# EAGLE schematic JCB_Circuit (EAGLE 9.5.2)
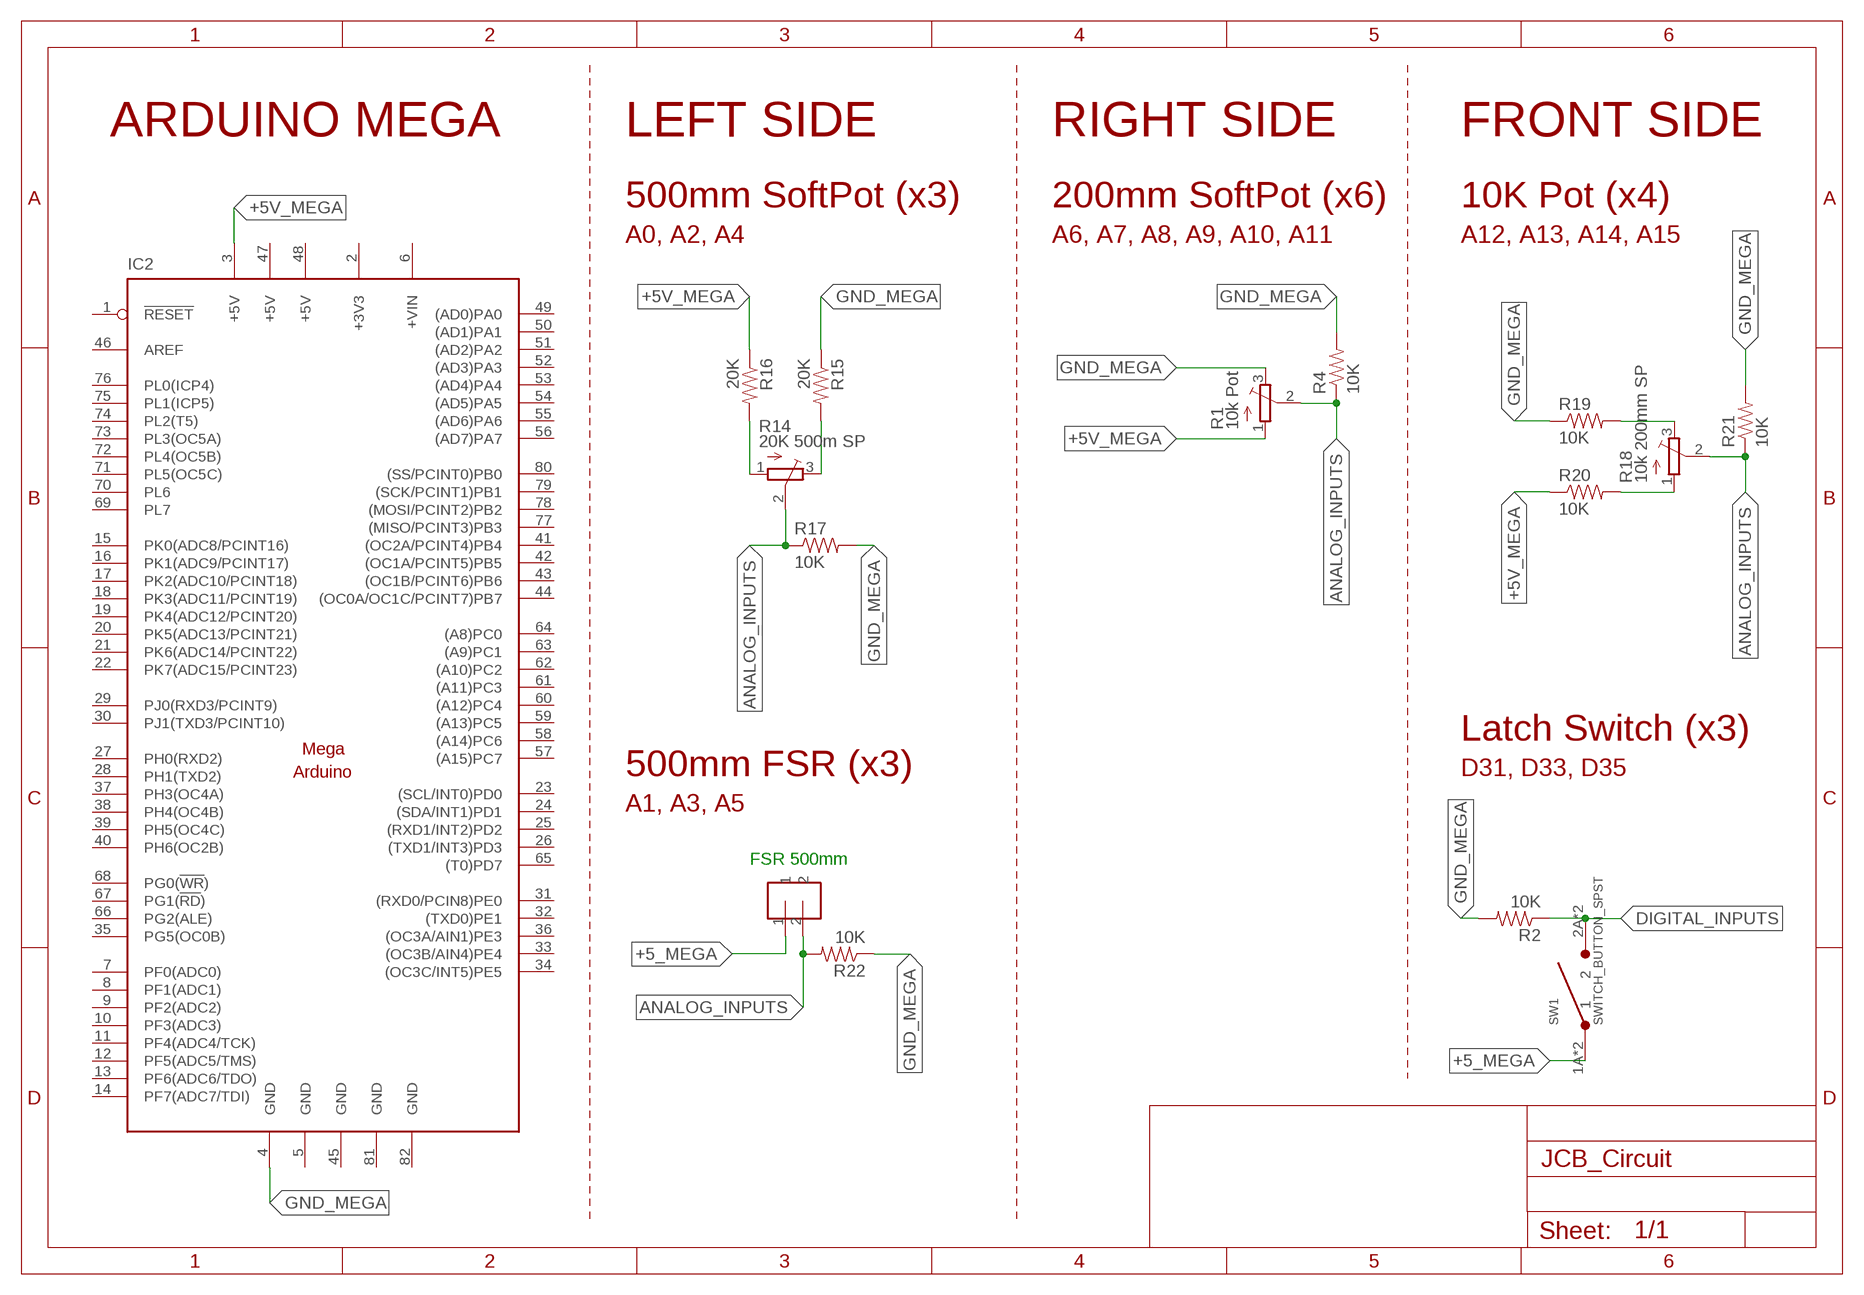
[diagram p0: schematic, sheet 1]

## Parts
IC2  MEGAARDUINO_1  [MEGA_ARDUINO]
R1  10k Pot  TRIM_EU-3223G  [3223G]
R2  10K  COMPONENT_RESISTOR-0805  [0805]
R4  10K  COMPONENT_RESISTOR-0805  [0805]
R14  20K 500m SP  TRIM_EU-3223G  [3223G]
R15  20K  COMPONENT_RESISTOR-0805  [0805]
R16  20K  COMPONENT_RESISTOR-0805  [0805]
R17  10K  COMPONENT_RESISTOR-0805  [0805]
R18  10k 200mm SP  TRIM_EU-3223G  [3223G]
R19  10K  COMPONENT_RESISTOR-0805  [0805]
R20  10K  COMPONENT_RESISTOR-0805  [0805]
R21  10K  COMPONENT_RESISTOR-0805  [0805]
R22  10K  COMPONENT_RESISTOR-0805  [0805]
SW1  SWITCH_BUTTON_SPST  [7914G-1-000E]
U$1  HEADER-2-DIP  [HEADER-2-DIP]

## Nets
+5_MEGA: SW1.1A SW1.1B U$1.1
+5V_MEGA: IC2.3(+5V) R1.1(A) R16.1 R20.1
ANALOG_INPUTS: R1.2(S) R4.1 R14.2(S) R17.1 R18.2(S) R21.1 R22.2 U$1.2
DIGITAL_INPUTS: R2.1 SW1.2A SW1.2B
GND_MEGA: IC2.4(GND) R1.3(E) R2.2 R4.2 R15.1 R17.2 R19.1 R21.2 R22.1
N$4: R14.3(E) R15.2
N$5: R14.1(A) R16.2
N$7: R18.3(E) R19.2
N$8: R18.1(A) R20.2
Unconnected: IC2.1(!RESET) IC2.7(PF0(ADC0)) IC2.8(PF1(ADC1)) IC2.9(PF2(ADC2)) IC2.10(PF3(ADC3)) IC2.11(PF4(ADC4/TCK)) IC2.12(PF5(ADC5/TMS)) IC2.13(PF6(ADC6/TDO)) IC2.14(PF7(ADC7/TDI)) IC2.15(PK0(ADC8/PCINT16)) IC2.16(PK1(ADC9/PCINT17)) IC2.17(PK2(ADC10/PCINT18)) IC2.18(PK3(ADC11/PCINT19)) IC2.19(PK4(ADC12/PCINT20)) IC2.20(PK5(ADC13/PCINT21)) IC2.21(PK6(ADC14/PCINT22)) IC2.22(PK7(ADC15/PCINT23)) IC2.23((SCL/INT0)PD0) IC2.24((SDA/INT1)PD1) IC2.25((RXD1/INT2)PD2) IC2.26((TXD1/INT3)PD3) IC2.27(PH0(RXD2)) IC2.28(PH1(TXD2)) IC2.29(PJ0(RXD3/PCINT9)) IC2.30(PJ1(TXD3/PCINT10)) IC2.31((RXD0/PCIN8)PE0) IC2.32((TXD0)PE1) IC2.33((OC3B/AIN4)PE4) IC2.34((OC3C/INT5)PE5) IC2.35(PG5(OC0B)) IC2.36((OC3A/AIN1)PE3) IC2.37(PH3(OC4A)) IC2.38(PH4(OC4B)) IC2.39(PH5(OC4C)) IC2.40(PH6(OC2B)) IC2.41((OC2A/PCINT4)PB4) IC2.42((OC1A/PCINT5)PB5) IC2.43((OC1B/PCINT6)PB6) IC2.44((OC0A/OC1C/PCINT7)PB7) IC2.46(AREF) IC2.49((AD0)PA0) IC2.50((AD1)PA1) IC2.51((AD2)PA2) IC2.52((AD3)PA3) IC2.53((AD4)PA4) IC2.54((AD5)PA5) IC2.55((AD6)PA6) IC2.56((AD7)PA7) IC2.57((A15)PC7) IC2.58((A14)PC6) IC2.59((A13)PC5) IC2.60((A12)PC4) IC2.61((A11)PC3) IC2.62((A10)PC2) IC2.63((A9)PC1) IC2.64((A8)PC0) IC2.65((T0)PD7) IC2.66(PG2(ALE)) IC2.67(PG1(!RD!)) IC2.68(PG0(!WR!)) IC2.69(PL7) IC2.70(PL6) IC2.71(PL5(OC5C)) IC2.72(PL4(OC5B)) IC2.73(PL3(OC5A)) IC2.74(PL2(T5)) IC2.75(PL1(ICP5)) IC2.76(PL0(ICP4)) IC2.77((MISO/PCINT3)PB3) IC2.78((MOSI/PCINT2)PB2) IC2.79((SCK/PCINT1)PB1) IC2.80((SS/PCINT0)PB0)

## Notes on the sheet
- ARDUINO MEGA | LEFT SIDE | RIGHT SIDE | FRONT SIDE
- 500mm SoftPot (x3) | 200mm SoftPot (x6) | 10K Pot (x4)
- A0, A2, A4 | A6, A7, A8, A9, A10, A11 | A12, A13, A14, A15
- Latch Switch (x3)
- 500mm FSR (x3) | D31, D33, D35
- A1, A3, A5
- FSR 500mm

## Power pins joined to a net without a drawn wire
+3V3: IC2.2(+3V3)
+5V: IC2.47(+5V) IC2.48(+5V)
+VIN: IC2.6(+VIN)
GND: IC2.5(GND) IC2.45(GND) IC2.81(GND) IC2.82(GND)

## Library data of the parts
IC2 = arduino:MEGAARDUINO_1: The Arduino Mega is a microcontroller board based on the ATmega1280. - 54 digital input/output pins (of which 14 can be used as PWM outputs) - 16 analog inputs - 4 UARTs (hardware serial ports) - 16 MHz crystal oscillator - USB connection - power jack - ICSP header - reset button It contains everything needed to support the microcontroller; simply connect it to a computer with a USB cable or power it with a AC-to-DC adapter or battery to get started. The Mega is compatible with most shields designed for the Arduino Duemilanove or Diecimila. http://arduino.cc/en/Main/ArduinoBoardMega
R1 R14 R18 = pot:TRIM_EU-: POTENTIOMETER
R2 R4 R15-R17 R19-R22 = homemade-hardware:COMPONENT_RESISTOR
SW1 = homemade-hardware:SWITCH_BUTTON_SPST: 7914G-1-000E <https://www.digikey.com/product-detail/en/bourns-inc/7914G-1-000E/7914G-000EDKR-ND/741386>: Momentary Button; HEIGHT: 4.2; PN: 7914G-1-000E
U$1 = homemade-hardware:HEADER-2: NPTC081KFXC-RC <https://www.digikey.com/product-detail/en/sullins-connector-solutions/NPTC081KFXC-RC/S5600-ND/776058>: Vertical Female SMD Headers TSM-110-01-T-SV <https://www.digikey.com/product-detail/en/samtec-inc/TSM-110-01-T-SV/SAM12267-ND/6691889>: Vertical Male SMD Headers M20-8890845 <https://www.digikey.com/products/en?keywords=952-3236-ND>: Horizontal Male SMD Headers M20-7910842R <https://www.digikey.com/product-detail/en/harwin-inc/M20-7910842R/952-3200-6-ND/6559341>: Horizontal Female SMD Headers